# Altium schematic sheet MainPartSCH.SchDoc
size A2; SheetNumber: 1; SheetTotal: 3
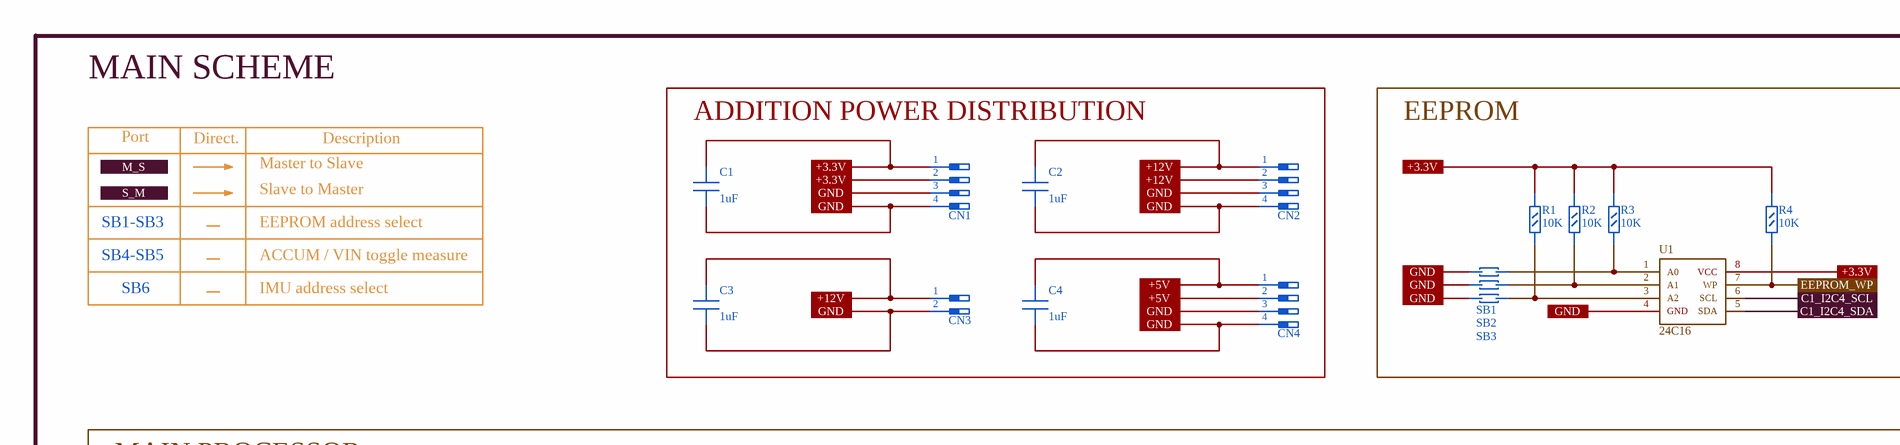
[diagram p0: MainPartSCH.SchDoc, top left]
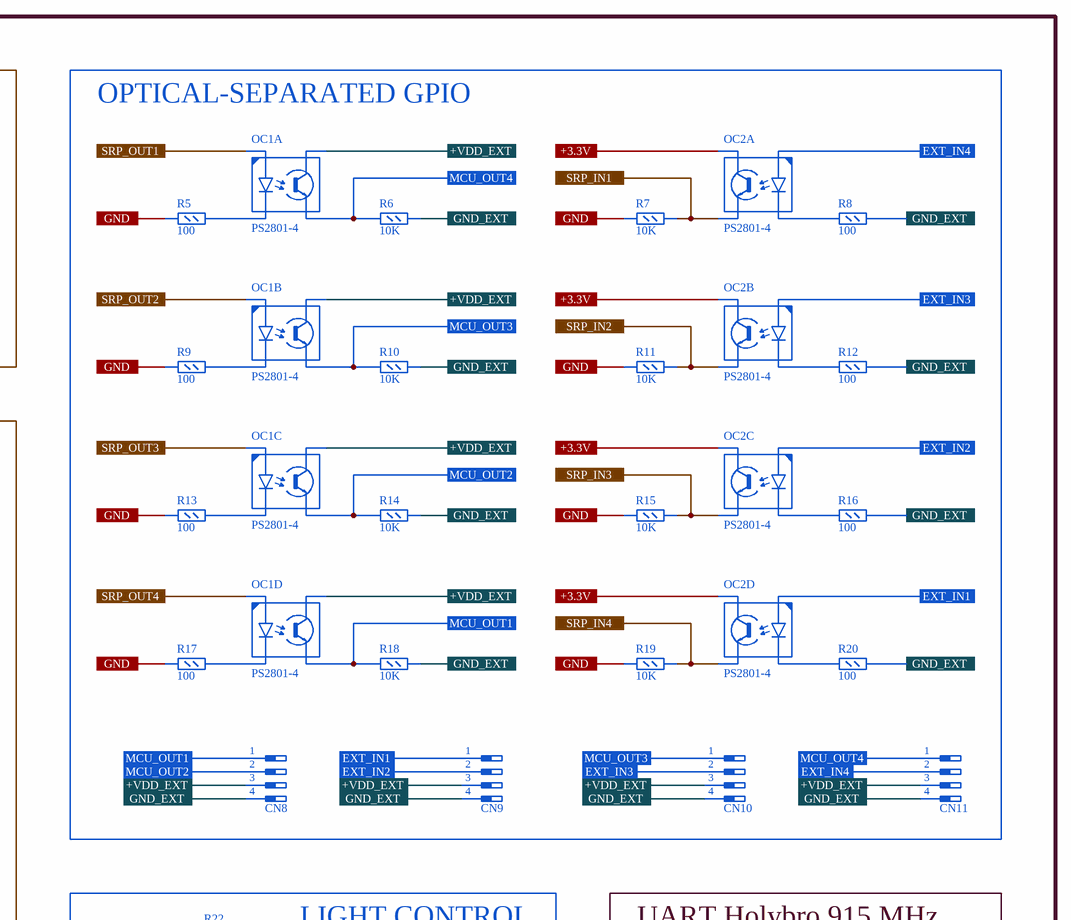
[diagram p1: MainPartSCH.SchDoc, top right]
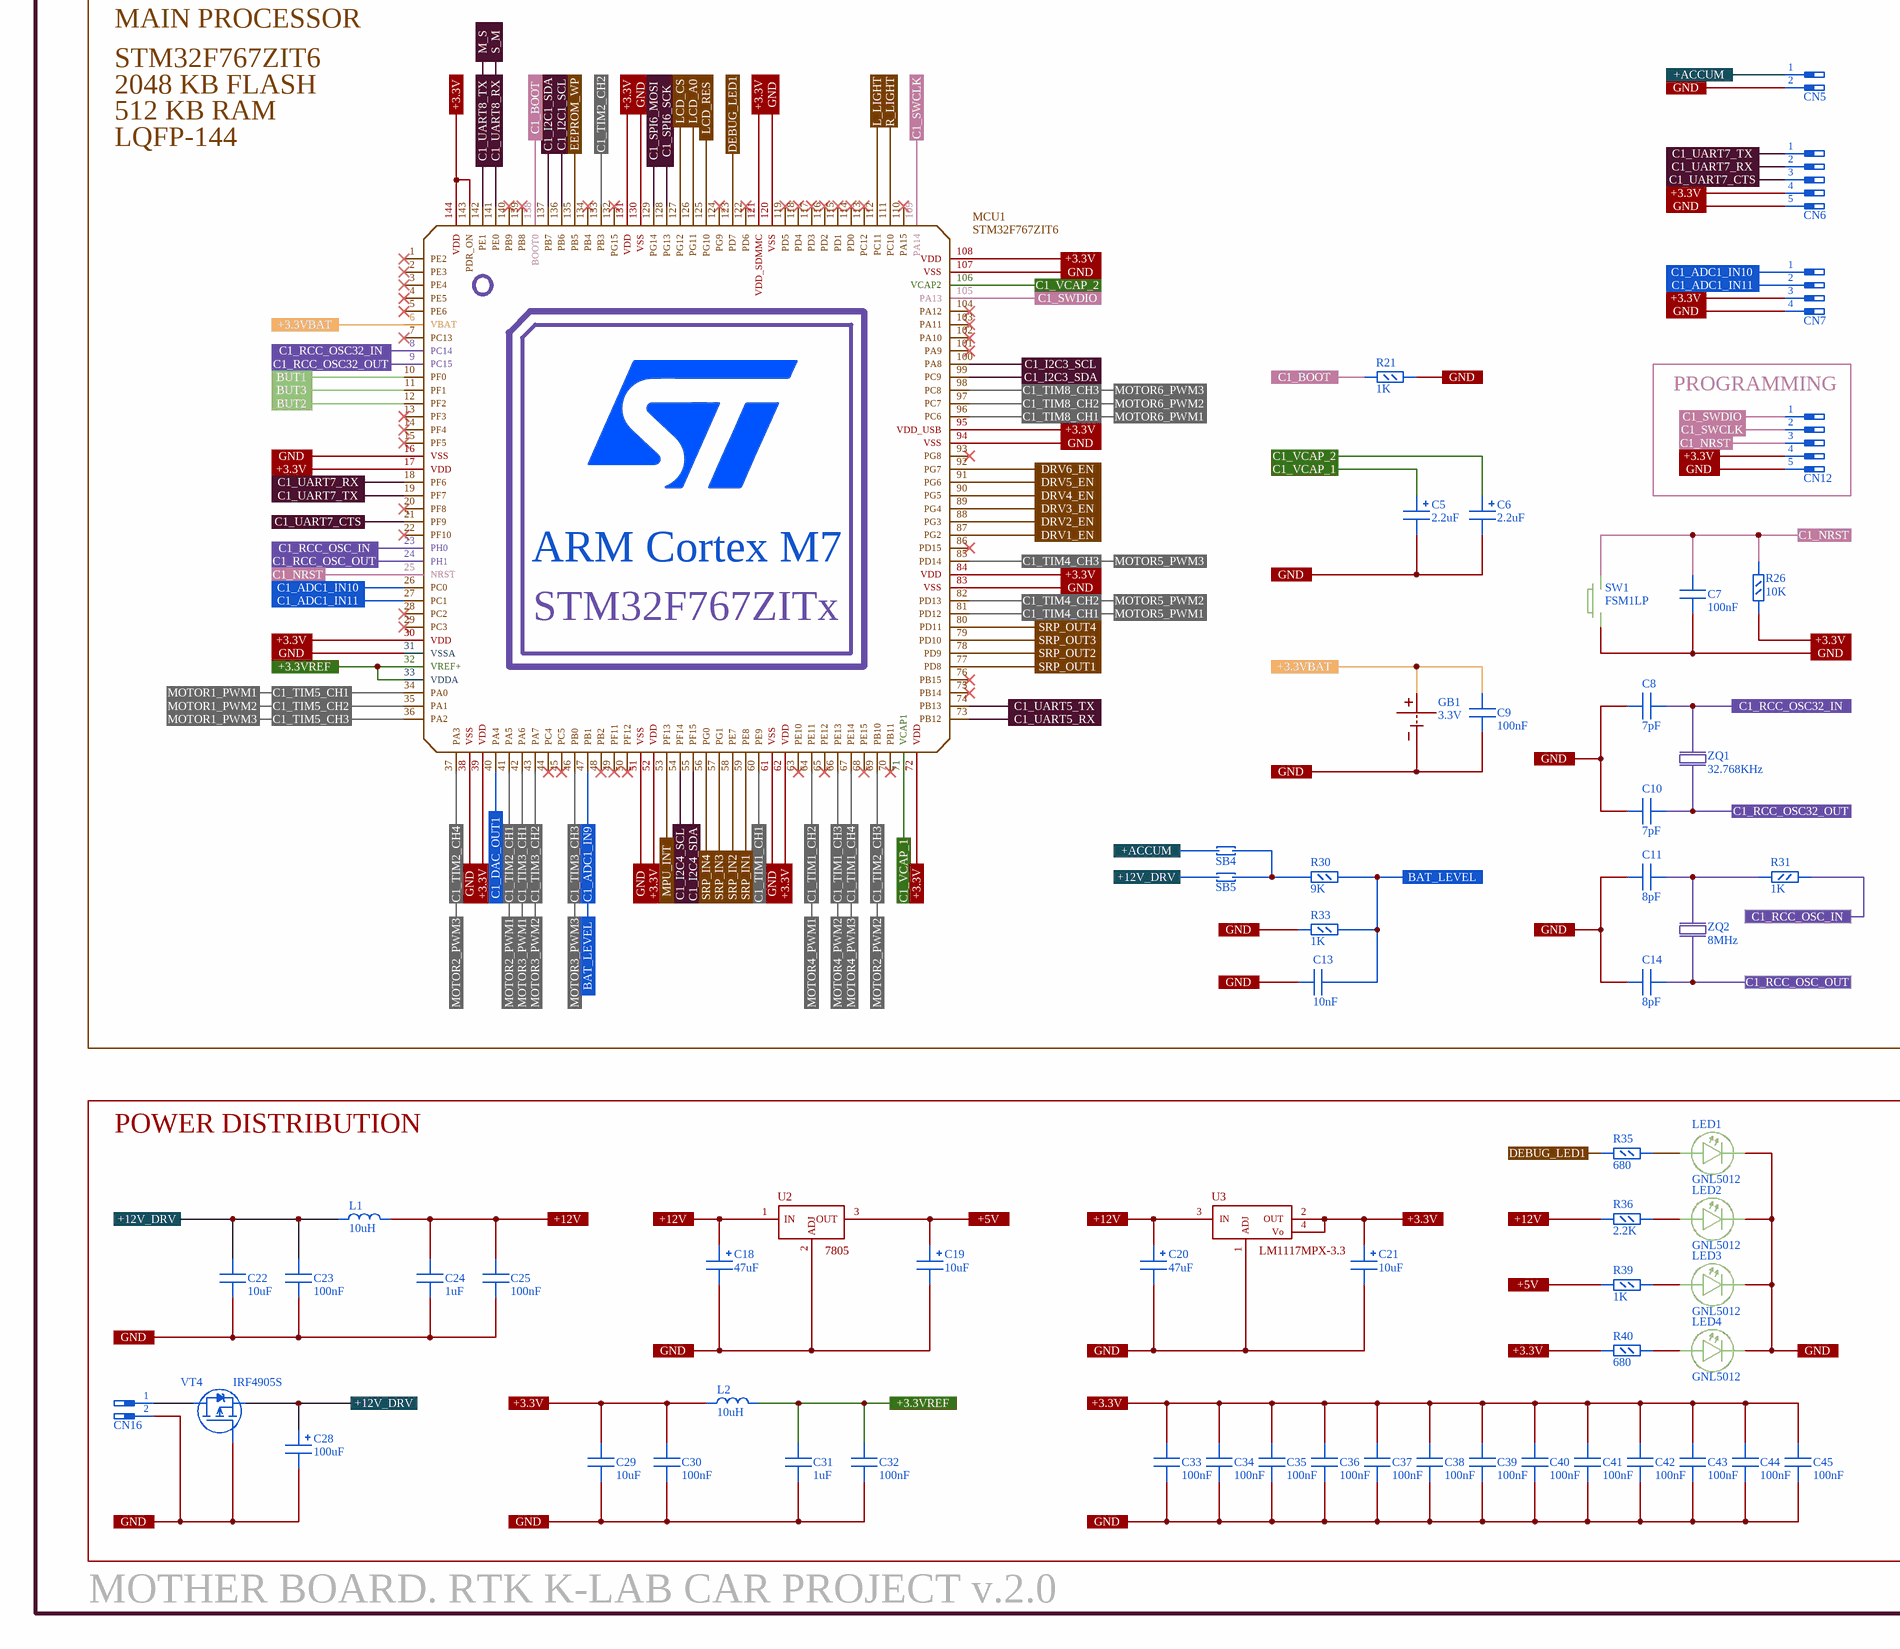
[diagram p2: MainPartSCH.SchDoc, bottom left]
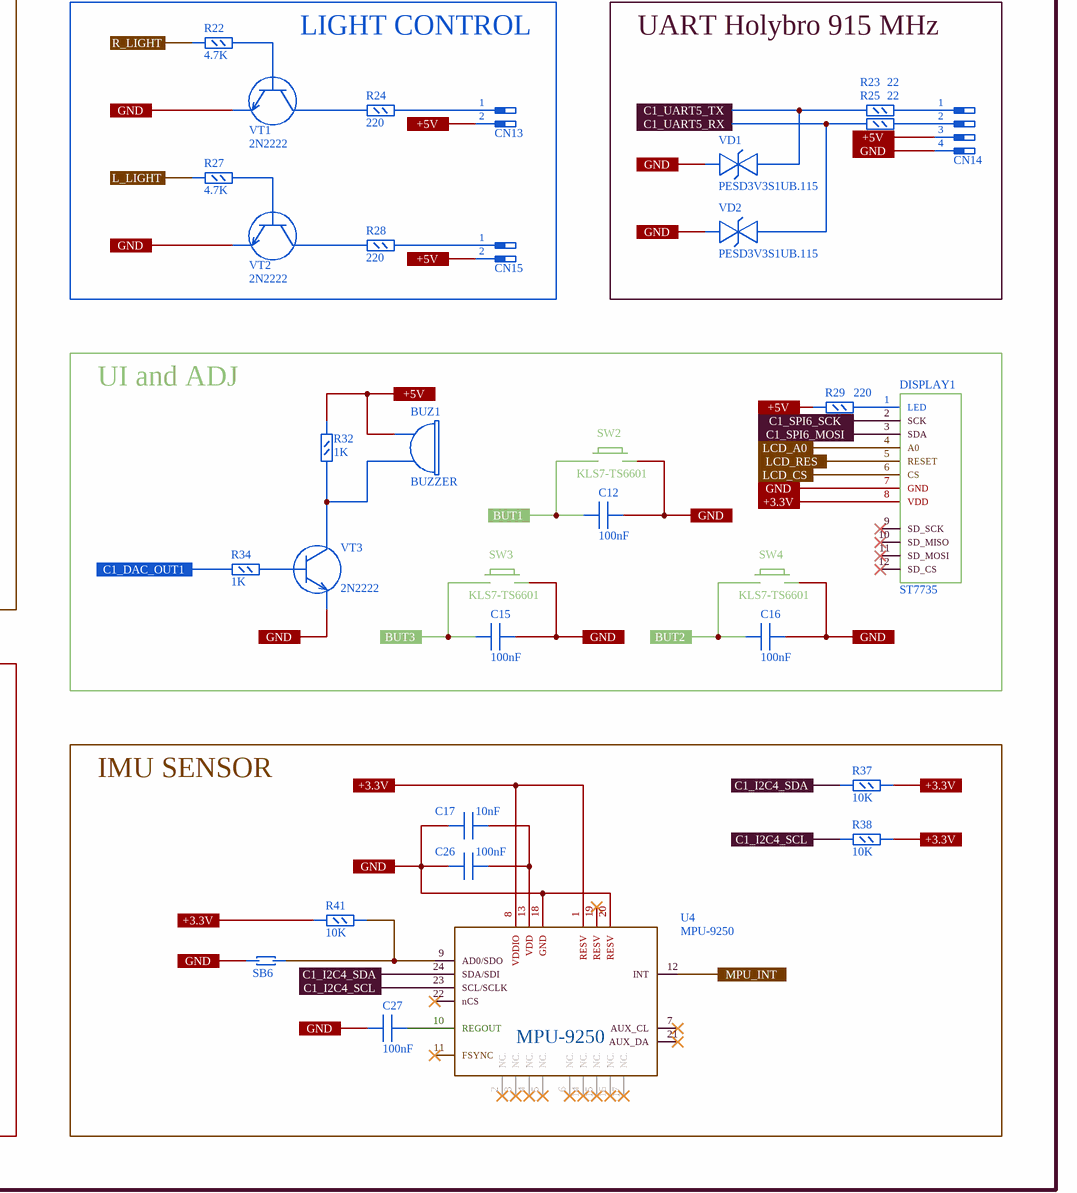
[diagram p3: MainPartSCH.SchDoc, bottom right]

## Parts
BUZ1  BUZZER  [BUZZER-5.08MM-D10.5MM]
C1  1uF  [C0805]
C2  1uF  [C0805]
C3  1uF  [C0805]
C4  1uF  [C0805]
C5  2.2uF  [CAP_TAN-A]
C6  2.2uF  [CAP_TAN-A]
C7  100nF  [C0603]
C8  7pF  [C0402]
C9  100nF  [C0603]
C10  7pF  [C0402]
C11  8pF  [C0402]
C12  100nF  [C0603]
C13  10nF  [C0603]
C14  8pF  [C0402]
C15  100nF  [C0603]
C16  100nF  [C0603]
C17  10nF  [C0603]
C18  47uF  [CAP_ALSMD-6.3x5.4MM]
C19  10uF  [CAP_ALSMD-4X5.4MM]
C20  47uF  [CAP_ALSMD-6.3x5.4MM]
C21  10uF  [CAP_ALSMD-4X5.4MM]
C22  10uF  [C0805]
C23  100nF  [C0603]
C24  1uF  [C0805]
C25  100nF  [C0603]
C26  100nF  [C0603]
C27  100nF  [C0603]
C28  100uF  [CAP_ALSMD-8X10.5MM]
C29  10uF  [C0805]
C30  100nF  [C0603]
C31  1uF  [C0805]
C32  100nF  [C0603]
C33  100nF  [C0603]
C34  100nF  [C0603]
C35  100nF  [C0603]
C36  100nF  [C0603]
C37  100nF  [C0603]
C38  100nF  [C0603]
C39  100nF  [C0603]
C40  100nF  [C0603]
C41  100nF  [C0603]
C42  100nF  [C0603]
C43  100nF  [C0603]
C44  100nF  [C0603]
C45  100nF  [C0603]
CN1  1x04  [XH2.54-4PIN]  (value not drawn)
CN2  1x04  [XH2.54-4PIN]  (value not drawn)
CN3  1x02  [XH2.54-2PIN]  (value not drawn)
CN4  1x04  [XH2.54-4PIN]  (value not drawn)
CN5  1x02  [2X1F]  (value not drawn)
CN6  1x05  [5X1F]  (value not drawn)
CN7  1x04  [4X1F]  (value not drawn)
CN8  1x04  [XH2.54-4PIN]  (value not drawn)
CN9  1x04  [XH2.54-4PIN]  (value not drawn)
CN10  1x04  [XH2.54-4PIN]  (value not drawn)
CN11  1x04  [XH2.54-4PIN]  (value not drawn)
CN12  1x05  [5X1M]  (value not drawn)
CN13  1x02  [2X1F]  (value not drawn)
CN14  1x04  [XH2.54-4PIN]  (value not drawn)
CN15  1x02  [2X1F]  (value not drawn)
CN16  1x02  [H2-5.08]  (value not drawn)
DISPLAY1  ST7735  [8X1M]
GB1  3.3V  [CR1616-SMD]
L1  10uH  [L1206]
L2  10uH  [L0805]
LED1  GNL5012  [LED0603]
LED2  GNL5012  [LED0603]
LED3  GNL5012  [LED0603]
LED4  GNL5012  [LED0603]
MCU1  STM32F767ZIT6  [LQFP144]
OC1  PS2801-4  [SSOP16]  (parts A,B,C,D of 4)
OC2  PS2801-4  [SSOP16]  (parts A,B,C,D of 4)
R1  10K  [R0603]
R2  10K  [R0603]
R3  10K  [R0603]
R4  10K  [R0603]
R5  100  [R0603]
R6  10K  [R0603]
R7  10K  [R0603]
R8  100  [R0603]
R9  100  [R0603]
R10  10K  [R0603]
R11  10K  [R0603]
R12  100  [R0603]
R13  100  [R0603]
R14  10K  [R0603]
R15  10K  [R0603]
R16  100  [R0603]
R17  100  [R0603]
R18  10K  [R0603]
R19  10K  [R0603]
R20  100  [R0603]
R21  1K  [R0603]
R22  4.7K  [R0603]
R23  22  [R0805]
R24  220  [R0603]
R25  22  [R0805]
R26  10K  [R0603]
R27  4.7K  [R0603]
R28  220  [R0603]
R29  220  [R0603]
R30  9K  [R0603]
R31  1K  [R0603]
R32  1K  [R0603]
R33  1K  [R0603]
R34  1K  [R0603]
R35  680  [R0603]
R36  2.2K  [R0603]
R37  10K  [R0603]
R38  10K  [R0603]
R39  1K  [R0603]
R40  680  [R0603]
R41  10K  [R0603]
SB1  Soldier Bridge  [SOLDBR]  (value not drawn)
SB2  Soldier Bridge  [SOLDBR]  (value not drawn)
SB3  Soldier Bridge  [SOLDBR]  (value not drawn)
SB4  Soldier Bridge  [SOLDBR]  (value not drawn)
SB5  Soldier Bridge  [SOLDBR]  (value not drawn)
SB6  Soldier Bridge  [SOLDBR]  (value not drawn)
SW1  FSM1LP  [BUT-SMD-8X6.2MM]
SW2  KLS7-TS6601  [BUT-6.5X4.5MM]
SW3  KLS7-TS6601  [BUT-6.5X4.5MM]
SW4  KLS7-TS6601  [BUT-6.5X4.5MM]
U1  24C16  [SOIC8]
U2  7805  [SOT-223]
U3  LM1117MPX-3.3  [SOT-223]
U4  MPU-9250  [QFN24]
VD1  PESD3V3S1UB.115  [SOD-323]
VD2  PESD3V3S1UB.115  [SOD-323]
VT1  2N2222  [SOT-23-123]
VT2  2N2222  [SOT-23-123]
VT3  2N2222  [SOT-23-123]
VT4  IRF4905S  [D2PAK]
ZQ1  32.768KHz  [NX3215SA]
ZQ2  8MHz  [NX5032GA]

## Blocks framed on the sheet
ADDITION POWER DISTRIBUTION: C1-C4 CN1-CN4
EEPROM: R1-R4 SB1-SB3 U1
PROGRAMMING: CN12
LIGHT CONTROL: CN13 CN15 R22 R24 R27 R28 VT1 VT2
UART Holybro 915 MHz: CN14 R23 R25 VD1 VD2
UI and ADJ: BUZ1 C12 C15 C16 DISPLAY1 R29 R32 R34 SW2-SW4 VT3
IMU SENSOR: C17 C26 C27 R37 R38 R41 SB6 U4

## Ports
+3.3V, +3.3VBAT, +3.3VREF, +5V, +12V, +12V_DRV, +ACCUM, +VDD_EXT, BAT_LEVEL, BUT1, BUT2, BUT3, C1_ADC1_IN9, C1_ADC1_IN10, C1_ADC1_IN11, C1_BOOT, C1_DAC_OUT1, C1_I2C1_SCL, C1_I2C1_SDA, C1_I2C3_SCL, C1_I2C3_SDA, C1_I2C4_SCL, C1_I2C4_SDA, C1_NRST, C1_RCC_OSC32_IN, C1_RCC_OSC32_OUT, C1_RCC_OSC_IN, C1_RCC_OSC_OUT, C1_SPI6_MOSI, C1_SPI6_SCK, C1_SWCLK, C1_SWDIO, C1_TIM1_CH1, C1_TIM1_CH2, C1_TIM1_CH3, C1_TIM1_CH4, C1_TIM2_CH1, C1_TIM2_CH2, C1_TIM2_CH3, C1_TIM2_CH4, C1_TIM3_CH1, C1_TIM3_CH2, C1_TIM3_CH3, C1_TIM4_CH1, C1_TIM4_CH2, C1_TIM4_CH3, C1_TIM5_CH1, C1_TIM5_CH2, C1_TIM5_CH3, C1_TIM8_CH1, C1_TIM8_CH2, C1_TIM8_CH3, C1_UART5_RX, C1_UART5_TX, C1_UART7_CTS, C1_UART7_RX, C1_UART7_TX, C1_UART8_RX, C1_UART8_TX, C1_VCAP_1, C1_VCAP_2, DEBUG_LED1, DRV1_EN, DRV2_EN, DRV3_EN, DRV4_EN, DRV5_EN, DRV6_EN, EEPROM_WP, EXT_IN1, EXT_IN2, EXT_IN3, EXT_IN4, GND, GND_EXT, L_LIGHT, LCD_A0, LCD_CS, LCD_RES, M_S, MCU_OUT1, MCU_OUT2, MCU_OUT3, MCU_OUT4, MOTOR1_PWM1, MOTOR1_PWM2, MOTOR1_PWM3, MOTOR2_PWM1, MOTOR2_PWM2, MOTOR2_PWM3, MOTOR3_PWM1, MOTOR3_PWM2, MOTOR3_PWM3, MOTOR4_PWM1, MOTOR4_PWM2, MOTOR4_PWM3, MOTOR5_PWM1, MOTOR5_PWM2, MOTOR5_PWM3, MOTOR6_PWM1, MOTOR6_PWM2, MOTOR6_PWM3, MPU_INT, R_LIGHT, S_M, SRP_IN1, SRP_IN2, SRP_IN3, SRP_IN4, SRP_OUT1, SRP_OUT2, SRP_OUT3, SRP_OUT4

## Nets
+3.3V: C1.2 C21.1 C29.2 C30.2 C33.2 C34.2 C35.2 C36.2 C37.2 C38.2 C39.2 C40.2 C41.2 C42.2 C43.2 C44.2 C45.2 CN1.1 CN1.2 CN6.4 CN7.3 CN12.4 DISPLAY1.8(VDD) L2.1 MCU1.17(VDD) MCU1.30(VDD) MCU1.39(VDD) MCU1.52(VDD) MCU1.62(VDD) MCU1.72(VDD) MCU1.84(VDD) MCU1.95(VDD_USB) MCU1.108(VDD) MCU1.121(VDD_SDMMC) MCU1.131(VDD) MCU1.143(PDR_ON) MCU1.144(VDD) OC2.10 OC2.12 OC2.14 OC2.16 R1.2 R2.2 R3.2 R4.2 R26.2 R37.2 R38.2 R40.2 R41.2 U1.8(VCC) U3.2(OUT) U3.4(Vo) U4.1(RESV) U4.8(VDDIO) ; port +3.3V
+3.3VBAT: C9.1 GB1.2 MCU1.6(VBAT) ; port +3.3VBAT
+3.3VREF: C31.2 C32.2 L2.2 MCU1.32(VREF+) MCU1.33(VDDA) ; port +3.3VREF
+5V: BUZ1.1 C4.2 C19.1 CN4.1 CN4.2 CN13.2 CN14.3 CN15.2 R29.1 R32.2 R39.2 U2.3(OUT) ; port +5V
+12V: C2.2 C3.2 C18.1 C20.1 C24.2 C25.2 CN2.1 CN2.2 CN3.1 L1.2 R36.2 U2.1(IN) U3.3(IN) ; port +12V
+12V_DRV: C22.2 C23.2 C28.1 L1.1 SB5.1 VT4.3(S) ; port +12V_DRV
+ACCUM: CN5.1 SB4.1 ; port +ACCUM
+VDD_EXT: CN8.3 CN9.3 CN10.3 CN11.3 OC1.10 OC1.12 OC1.14 OC1.16 ; port +VDD_EXT
BAT_LEVEL: C13.2 MCU1.47(PB1) R30.2 R33.2 ; port C1_ADC1_IN9, port BAT_LEVEL
BUT1: C12.2 MCU1.10(PF0) SW2.1(Q1) ; port BUT1
BUT2: C16.2 MCU1.12(PF2) SW4.1(Q1) ; port BUT2
BUT3: C15.2 MCU1.11(PF1) SW3.1(Q1) ; port BUT3
C1_ADC1_IN10: CN7.1 MCU1.26(PC0) ; port C1_ADC1_IN10
C1_ADC1_IN11: CN7.2 MCU1.27(PC1) ; port C1_ADC1_IN11
C1_BOOT: MCU1.138(BOOT0) R21.2 ; port C1_BOOT
C1_DAC_OUT1: MCU1.40(PA4) R34.1 ; port C1_DAC_OUT1
C1_I2C1_SCL: MCU1.136(PB6) ; port C1_I2C1_SCL
C1_I2C1_SDA: MCU1.137(PB7) ; port C1_I2C1_SDA
C1_I2C3_SCL: MCU1.100(PA8) ; port C1_I2C3_SCL
C1_I2C3_SDA: MCU1.99(PC9) ; port C1_I2C3_SDA
C1_I2C4_SCL: MCU1.54(PF14) R38.1 U1.6(SCL) U4.23(SCL/SCLK) ; port C1_I2C4_SCL
C1_I2C4_SDA: MCU1.55(PF15) R37.1 U1.5(SDA) U4.24(SDA/SDI) ; port C1_I2C4_SDA
C1_NRST: C7.2 CN12.3 MCU1.25(NRST) R26.1 SW1.3(Q2) ; port C1_NRST
C1_RCC_OSC32_IN: C8.1 MCU1.8(PC14) ZQ1.1 ; port C1_RCC_OSC32_IN
C1_RCC_OSC32_OUT: C10.1 MCU1.9(PC15) ZQ1.2 ; port C1_RCC_OSC32_OUT
C1_RCC_OSC_IN: MCU1.23(PH0) R31.1 ; port C1_RCC_OSC_IN
C1_RCC_OSC_OUT: C14.1 MCU1.24(PH1) ZQ2.2 ; port C1_RCC_OSC_OUT
C1_SPI6_MOSI: DISPLAY1.3(SDA) MCU1.129(PG14) ; port C1_SPI6_MOSI
C1_SPI6_SCK: DISPLAY1.2(SCK) MCU1.128(PG13) ; port C1_SPI6_SCK
C1_SWCLK: CN12.2 MCU1.109(PA14) ; port C1_SWCLK
C1_SWDIO: CN12.1 MCU1.105(PA13) ; port C1_SWDIO
C1_TIM1_CH1: MCU1.60(PE9) ; port C1_TIM1_CH1
C1_TIM1_CH2: MCU1.64(PE11) ; port C1_TIM1_CH2, port MOTOR4_PWM1
C1_TIM1_CH3: MCU1.66(PE13) ; port C1_TIM1_CH3, port MOTOR4_PWM2
C1_TIM1_CH4: MCU1.67(PE14) ; port C1_TIM1_CH4, port MOTOR4_PWM3
C1_TIM2_CH1: MCU1.41(PA5) ; port C1_TIM2_CH1, port MOTOR2_PWM1
C1_TIM2_CH2: MCU1.133(PB3) ; port C1_TIM2_CH2
C1_TIM2_CH3: MCU1.69(PB10) ; port C1_TIM2_CH3, port MOTOR2_PWM2
C1_TIM2_CH4: MCU1.37(PA3) ; port C1_TIM2_CH4, port MOTOR2_PWM3
C1_TIM3_CH1: MCU1.42(PA6) ; port C1_TIM3_CH1, port MOTOR3_PWM1
C1_TIM3_CH2: MCU1.43(PA7) ; port C1_TIM3_CH2, port MOTOR3_PWM2
C1_TIM3_CH3: MCU1.46(PB0) ; port C1_TIM3_CH3, port MOTOR3_PWM3
C1_TIM4_CH1: MCU1.81(PD12) ; port C1_TIM4_CH1, port MOTOR5_PWM1
C1_TIM4_CH2: MCU1.82(PD13) ; port C1_TIM4_CH2, port MOTOR5_PWM2
C1_TIM4_CH3: MCU1.85(PD14) ; port C1_TIM4_CH3, port MOTOR5_PWM3
C1_TIM5_CH1: MCU1.34(PA0) ; port C1_TIM5_CH1, port MOTOR1_PWM1
C1_TIM5_CH2: MCU1.35(PA1) ; port C1_TIM5_CH2, port MOTOR1_PWM2
C1_TIM5_CH3: MCU1.36(PA2) ; port C1_TIM5_CH3, port MOTOR1_PWM3
C1_TIM8_CH1: MCU1.96(PC6) ; port C1_TIM8_CH1, port MOTOR6_PWM1
C1_TIM8_CH2: MCU1.97(PC7) ; port C1_TIM8_CH2, port MOTOR6_PWM2
C1_TIM8_CH3: MCU1.98(PC8) ; port C1_TIM8_CH3, port MOTOR6_PWM3
C1_UART5_RX: MCU1.73(PB12) R25.1 VD2.2 ; port C1_UART5_RX
C1_UART5_TX: MCU1.74(PB13) R23.1 VD1.2 ; port C1_UART5_TX
C1_UART7_CTS: CN6.3 MCU1.21(PF9) ; port C1_UART7_CTS
C1_UART7_RX: CN6.2 MCU1.18(PF6) ; port C1_UART7_RX
C1_UART7_TX: CN6.1 MCU1.19(PF7) ; port C1_UART7_TX
C1_UART8_RX: MCU1.141(PE0) ; port C1_UART8_RX, port S_M
C1_UART8_TX: MCU1.142(PE1) ; port C1_UART8_TX, port M_S
C1_VCAP_1: C5.1 MCU1.71(VCAP1) ; port C1_VCAP_1
C1_VCAP_2: C6.1 MCU1.106(VCAP2) ; port C1_VCAP_2
DEBUG_LED1: MCU1.123(PD7) R35.2 ; port DEBUG_LED1
DRV1_EN: MCU1.87(PG2) ; port DRV1_EN
DRV2_EN: MCU1.88(PG3) ; port DRV2_EN
DRV3_EN: MCU1.89(PG4) ; port DRV3_EN
DRV4_EN: MCU1.90(PG5) ; port DRV4_EN
DRV5_EN: MCU1.91(PG6) ; port DRV5_EN
DRV6_EN: MCU1.92(PG7) ; port DRV6_EN
EEPROM_WP: MCU1.135(PB5) R4.1 U1.7(WP) ; port EEPROM_WP
EXT_IN1: CN9.1 OC2.7 ; port EXT_IN1
EXT_IN2: CN9.2 OC2.5 ; port EXT_IN2
EXT_IN3: CN10.2 OC2.3 ; port EXT_IN3
EXT_IN4: CN11.2 OC2.1 ; port EXT_IN4
GND: C1.1 C2.1 C3.1 C4.1 C5.2 C6.2 C7.1 C8.2 C9.2 C10.2 C11.2 C12.1 C13.1 C14.2 C15.1 C16.1 C17.1 C18.2 C19.2 C20.2 C21.2 C22.1 C23.1 C24.1 C25.1 C26.1 C27.1 C28.2 C29.1 C30.1 C31.1 C32.1 C33.1 C34.1 C35.1 C36.1 C37.1 C38.1 C39.1 C40.1 C41.1 C42.1 C43.1 C44.1 C45.1 CN1.3 CN1.4 CN2.3 CN2.4 CN3.2 CN4.3 CN4.4 CN5.2 CN6.5 CN7.4 CN12.5 CN14.4 CN16.2 DISPLAY1.7(GND) GB1.1(+) LED1.2 LED2.2 LED3.2 LED4.2 MCU1.16(VSS) MCU1.31(VSSA) MCU1.38(VSS) MCU1.51(VSS) MCU1.61(VSS) MCU1.83(VSS) MCU1.94(VSS) MCU1.107(VSS) MCU1.120(VSS) MCU1.130(VSS) R5.1 R7.1 R9.1 R11.1 R13.1 R15.1 R17.1 R19.1 R21.1 R33.1 SB1.1 SB2.1 SB3.1 SB6.1 SW1.1(Q1) SW2.3(Q2) SW3.3(Q2) SW4.3(Q2) U1.4(GND) U2.2(ADJ) U3.1(ADJ) U4.18(GND) U4.20(RESV) VD1.1 VD2.1 VT1.3 VT2.3 VT3.3 VT4.1(G) ; port GND
GND_EXT: CN8.4 CN9.4 CN10.4 CN11.4 R6.2 R8.2 R10.2 R12.2 R14.2 R16.2 R18.2 R20.2 ; port GND_EXT
L_LIGHT: MCU1.112(PC11) R27.1 ; port L_LIGHT
LCD_A0: DISPLAY1.4(A0) MCU1.126(PG11) ; port LCD_A0
LCD_CS: DISPLAY1.6(CS) MCU1.127(PG12) ; port LCD_CS
LCD_RES: DISPLAY1.5(RESET) MCU1.125(PG10) ; port LCD_RES
MCU_OUT1: CN8.1 OC1.9 R18.1 ; port MCU_OUT1
MCU_OUT2: CN8.2 OC1.11 R14.1 ; port MCU_OUT2
MCU_OUT3: CN10.1 OC1.13 R10.1 ; port MCU_OUT3
MCU_OUT4: CN11.1 OC1.15 R6.1 ; port MCU_OUT4
MPU_INT: MCU1.53(PF13) U4.12(INT) ; port MPU_INT
R_LIGHT: MCU1.111(PC10) R22.1 ; port R_LIGHT
SRP_IN1: MCU1.59(PE8) OC2.15 R7.2 ; port SRP_IN1
SRP_IN2: MCU1.58(PE7) OC2.13 R11.2 ; port SRP_IN2
SRP_IN3: MCU1.57(PG1) OC2.11 R15.2 ; port SRP_IN3
SRP_IN4: MCU1.56(PG0) OC2.9 R19.2 ; port SRP_IN4
SRP_OUT1: MCU1.77(PD8) OC1.1 ; port SRP_OUT1
SRP_OUT2: MCU1.78(PD9) OC1.3 ; port SRP_OUT2
SRP_OUT3: MCU1.79(PD10) OC1.5 ; port SRP_OUT3
SRP_OUT4: MCU1.80(PD11) OC1.7 ; port SRP_OUT4
NetBUZ1_2: BUZ1.2 R32.1 VT3.1
NetC11_1: C11.1 R31.2 ZQ2.1
NetC17_2: C17.2 C26.2 U4.13(VDD)
NetC27_2: C27.2 U4.10(REGOUT)
NetCN13_1: CN13.1 R24.2
NetCN14_1: CN14.1 R23.2
NetCN14_2: CN14.2 R25.2
NetCN15_1: CN15.1 R28.2
NetCN16_1: CN16.1 VT4.2(D)
NetDISPLAY1_1: DISPLAY1.1(LED) R29.2
NetLED1_1: LED1.1 R35.1
NetLED2_1: LED2.1 R36.1
NetLED3_1: LED3.1 R39.1
NetLED4_1: LED4.1 R40.1
NetOC1_2: OC1.2 R5.2
NetOC1_4: OC1.4 R9.2
NetOC1_6: OC1.6 R13.2
NetOC1_8: OC1.8 R17.2
NetOC2_2: OC2.2 R8.1
NetOC2_4: OC2.4 R12.1
NetOC2_6: OC2.6 R16.1
NetOC2_8: OC2.8 R20.1
NetR1_1: R1.1 SB3.2 U1.3(A2)
NetR2_1: R2.1 SB2.2 U1.2(A1)
NetR3_1: R3.1 SB1.2 U1.1(A0)
NetR22_2: R22.2 VT1.2
NetR24_1: R24.1 VT1.1
NetR27_2: R27.2 VT2.2
NetR28_1: R28.1 VT2.1
NetR30_1: R30.1 SB4.2 SB5.2
NetR34_2: R34.2 VT3.2
NetR41_1: R41.1 SB6.2 U4.9(AD0/SDO)

Not connected (* = marked no-connect by the designer): DISPLAY1 9(SD_SCK)* 10(SD_MISO)* 11(SD_MOSI)* 12(SD_CS)*; MCU1 1(PE2)* 2(PE3)* 3(PE4)* 4(PE5)* 5(PE6)* 7(PC13)* 13(PF3)* 14(PF4)* 15(PF5)* 20(PF8)* 22(PF10)* 28(PC2)* 29(PC3)* 44(PC4)* 45(PC5)* 48(PB2)* 49(PF11)* 50(PF12)* 63(PE10)* 65(PE12)* 68(PE15)* 70(PB11)* 75(PB14)* 76(PB15)* 86(PD15)* 93(PG8)* 101(PA9)* 102(PA10)* 103(PA11)* 104(PA12)* 110(PA15)* 113(PC12)* 114(PD0)* 115(PD1)* 116(PD2)* 117(PD3)* 118(PD4)* 119(PD5)* 122(PD6)* 124(PG9)* 132(PG15)* 134(PB4)* 139(PB8)* 140(PB9)*; SW1 2(Q1) 4(Q2); SW2 2(Q1) 4(Q2); SW3 2(Q1) 4(Q2); SW4 2(Q1) 4(Q2); U4 2(NC.)* 3(NC.)* 4(NC.)* 5(NC.)* 6(NC.)* 7(AUX_CL)* 11(FSYNC)* 14(NC.)* 15(NC.)* 16(NC.)* 17(NC.)* 19(RESV)* 21(AUX_DA)* 22(nCS)*

## Notes on the sheet
- MAIN SCHEME
- (near OC1) OPTICAL-SEPARATED GPIO
- Port
- Direct.
- Master to Slave
- Description
- SB1-SB3
- SB4-SB5
- Slave to Master
- EEPROM address select
- ACCUM / VIN toggle measure
- SB6
- IMU address select
- MAIN PROCESSOR
- STM32F767ZIT6
- 2048 KB FLASH
- 512 KB RAM
- LQFP-144
- POWER DISTRIBUTION
- MOTHER BOARD. RTK K-LAB CAR PROJECT v.2.0
- (in symbol STM32F767ZITx) ARM Cortex M7

## Library data of the parts
C1-C4 C7-C17 C22-C27 C29-C45 = Cap
  C1-C4 C24 C31: Value: 1uF
  C7 C9 C12 C15 C16 C23 C25-C27 C30 C32-C45: Value: 100nF
  C8 C10: Value: 7pF
  C11 C14: Value: 8pF
  C13 C17: Value: 10nF
  C22 C29: Value: 10uF
C5 C6 = Cap_Pol: Value: 2.2uF
C18-C21 C28 = Cap Pol
  C18 C20: Value: 47uF
  C19 C21: Value: 10uF
  C28: Value: 100uF
DISPLAY1 = ST7735 SPI Display + SD Card: 120x160 LCD Display; Name: ST7735
GB1 = Battery: Value: 3.3V; Type: CR1616
L1 L2 = Inductor: Value: 10uH
LED1-LED4 = LED: Name: GNL5012
MCU1 = STM32F767ZITx: Frequency: 216 MHz; Flash: 2048 kBytes; RAM: 512 kBytes; Name: STM32F767ZIT6
OC1 OC2 = Optocoupler-4: Name: PS2801-4
R1-R41 = Res
  R1-R4 R6 R7 R10 R11 R14 R15 R18 R19 R26 R37 R38 R41: Value: 10K
  R5 R8 R9 R12 R13 R16 R17 R20: Value: 100
  R21 R31-R34 R39: Value: 1K
  R22 R27: Value: 4.7K
  R23 R25: Value: 22
  R24 R28 R29: Value: 220
  R30: Value: 9K
  R35 R40: Value: 680
  R36: Value: 2.2K
SW1-SW4 = Button
  SW1: Name: FSM1LP
  SW2-SW4: Name: KLS7-TS6601
U1 = 24C16: Two-Wire I2C Serial EEPROM; Name: 24C16
U2 = LM7805: Name: 7805
U3 = LM1117: Name: LM1117MPX-3.3
VD1 VD2 = Suppressor: Value: 5.2V; Name: PESD3V3S1UB.115
VT1-VT3 = NPN: Name: 2N2222
VT4 = MOSFET-P: Name: IRF4905S
ZQ1 ZQ2 = Crystall
  ZQ1: Value: 32.768KHz; Name: NX3215SA
  ZQ2: Value: 8MHz; Name: NX5032GA
BUZ1 = Buzzer: Name: BUZZER
U4 = MPU-9250: Name: MPU-9250